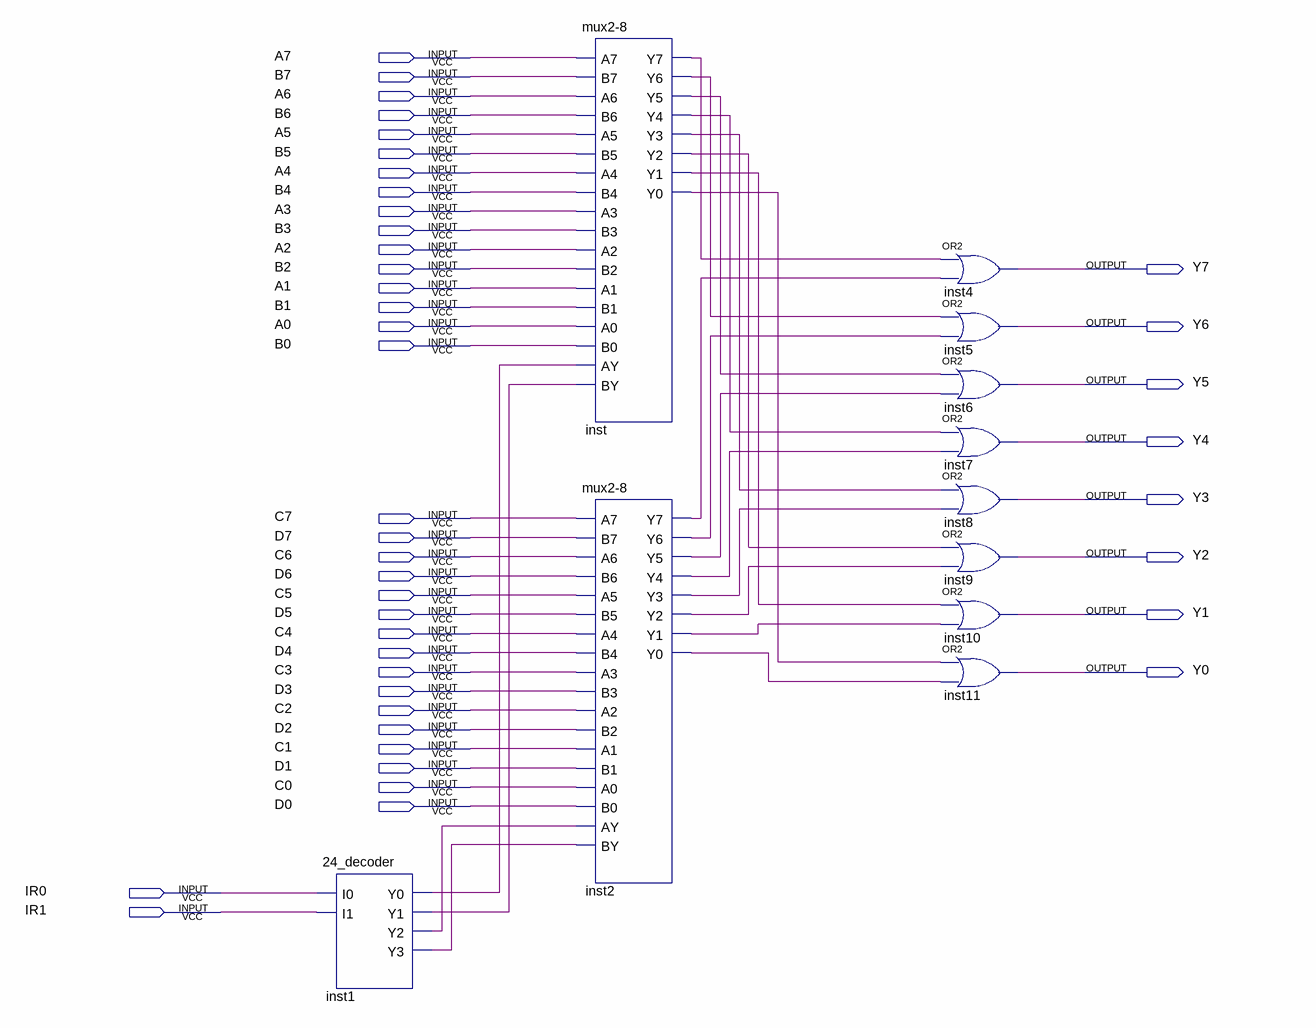
[diagram p0: schematic sheet]
// Quartus schematic mux4-8.bdf as structural Verilog: 11 symbols, 42 pins
module \mux4-8  (
  input  A7,
  input  B7,
  input  A6,
  input  B6,
  input  A5,
  input  B5,
  input  A4,
  input  B4,
  input  A3,
  input  B3,
  input  A2,
  input  B2,
  input  A1,
  input  B1,
  input  A0,
  input  B0,
  input  C7,
  input  D7,
  input  C6,
  input  D6,
  input  C5,
  input  D5,
  input  C4,
  input  D4,
  input  C3,
  input  D3,
  input  C2,
  input  D2,
  input  C1,
  input  D1,
  input  C0,
  input  D0,
  input  IR0,
  input  IR1,
  output Y7,
  output Y6,
  output Y5,
  output Y4,
  output Y3,
  output Y2,
  output Y1,
  output Y0
);

  wire inst1_y0, inst1_y1, inst1_y2, inst1_y3, inst2_y0, inst2_y1, inst2_y2, inst2_y3, inst2_y4, inst2_y5,
       inst2_y6, inst2_y7, inst_y0, inst_y1, inst_y2, inst_y3, inst_y4, inst_y5, inst_y6, inst_y7;

  \24_decoder  inst1 (.I0(IR0), .I1(IR1), .Y0(inst1_y0), .Y1(inst1_y1), .Y2(inst1_y2), .Y3(inst1_y3));
  \mux2-8  inst (
    .A7(A7), .B7(B7), .A6(A6), .B6(B6), .A5(A5), .B5(B5), .A4(A4), .B4(B4), .A3(A3), .B3(B3), .A2(A2),
    .B2(B2), .A1(A1), .B1(B1), .A0(A0), .B0(B0), .AY(inst1_y0), .BY(inst1_y1), .Y7(inst_y7), .Y6(inst_y6),
    .Y5(inst_y5), .Y4(inst_y4), .Y3(inst_y3), .Y2(inst_y2), .Y1(inst_y1), .Y0(inst_y0));
  \mux2-8  inst2 (
    .A7(C7), .B7(D7), .A6(C6), .B6(D6), .A5(C5), .B5(D5), .A4(C4), .B4(D4), .A3(C3), .B3(D3), .A2(C2),
    .B2(D2), .A1(C1), .B1(D1), .A0(C0), .B0(D0), .AY(inst1_y2), .BY(inst1_y3), .Y7(inst2_y7), .Y6(inst2_y6),
    .Y5(inst2_y5), .Y4(inst2_y4), .Y3(inst2_y3), .Y2(inst2_y2), .Y1(inst2_y1), .Y0(inst2_y0));
  or inst4 (Y7, inst_y7, inst2_y7);
  or inst5 (Y6, inst_y6, inst2_y6);
  or inst6 (Y5, inst_y5, inst2_y5);
  or inst7 (Y4, inst_y4, inst2_y4);
  or inst8 (Y3, inst_y3, inst2_y3);
  or inst9 (Y2, inst_y2, inst2_y2);
  or inst10 (Y1, inst_y1, inst2_y1);
  or inst11 (Y0, inst_y0, inst2_y0);
endmodule
